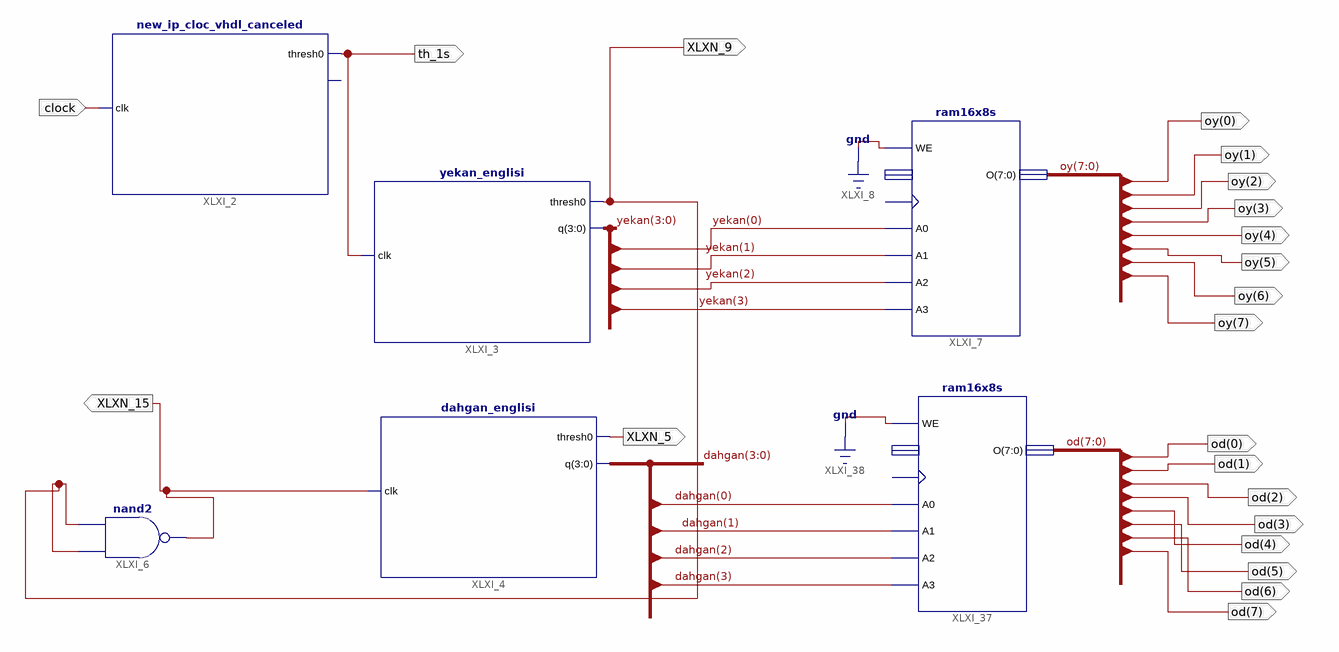
[diagram p0: schematic sheet 1]
// Xilinx ISE schematic clock_vhdl_canceled_schematic.sch (spartan3) as structural Verilog: 6 symbols, 21 ports
module clock_vhdl_canceled_schematic (
  input  clock,
  output XLXN_5,
  output XLXN_15,
  output XLXN_9,
  output [7:0] od,
  output [7:0] oy,
  output th_1s
);

  wire [3:0] dahgan, yekan;

  new_ip_cloc_vhdl_canceled XLXI_2 (.clk(clock), .thresh0(th_1s));  // open: q
  yekan_englisi XLXI_3 (.clk(th_1s), .thresh0(XLXN_9), .q(yekan));
  dahgan_englisi XLXI_4 (.clk(XLXN_15), .thresh0(XLXN_5), .q(dahgan));
  nand XLXI_6 (XLXN_15, XLXN_9, XLXN_9);
  ram16x8s #(.INIT_06("0012"), .INIT_05("0060"), .INIT_04("0004"), .INIT_03("0092"), .INIT_02("02ba"), .INIT_01("008e"), .INIT_00("0083")) XLXI_7 (
    .A0(yekan[0]), .A1(yekan[1]), .A2(yekan[2]), .A3(yekan[3]), .WE(1'b0), .O(oy));  // open: D, WCLK
  ram16x8s #(.INIT_06("0012"), .INIT_05("0060"), .INIT_04("0004"), .INIT_03("0092"), .INIT_02("02ba"), .INIT_01("008e"), .INIT_00("0083")) XLXI_37 (
    .A0(dahgan[0]), .A1(dahgan[1]), .A2(dahgan[2]), .A3(dahgan[3]), .WE(1'b0), .O(od));  // open: D, WCLK
endmodule
